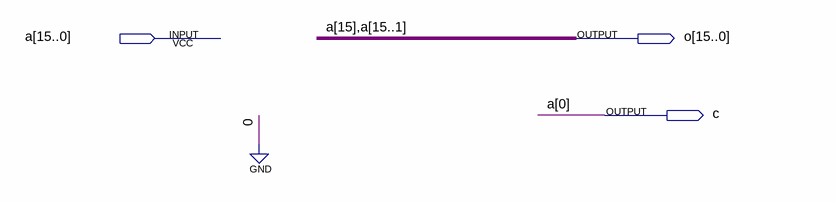
[diagram p0: schematic sheet]
// Quartus schematic AR_SR16.bdf as structural Verilog: 0 symbols, 3 pins
module AR_SR16 (
  input  [15:0] a,
  output [15:0] o,
  output c
);


  assign c = a[0];
  assign o = {{2{a[15]}}, a[14:1]};
endmodule
